# Altium project FafulaNandor25.PrjPcb
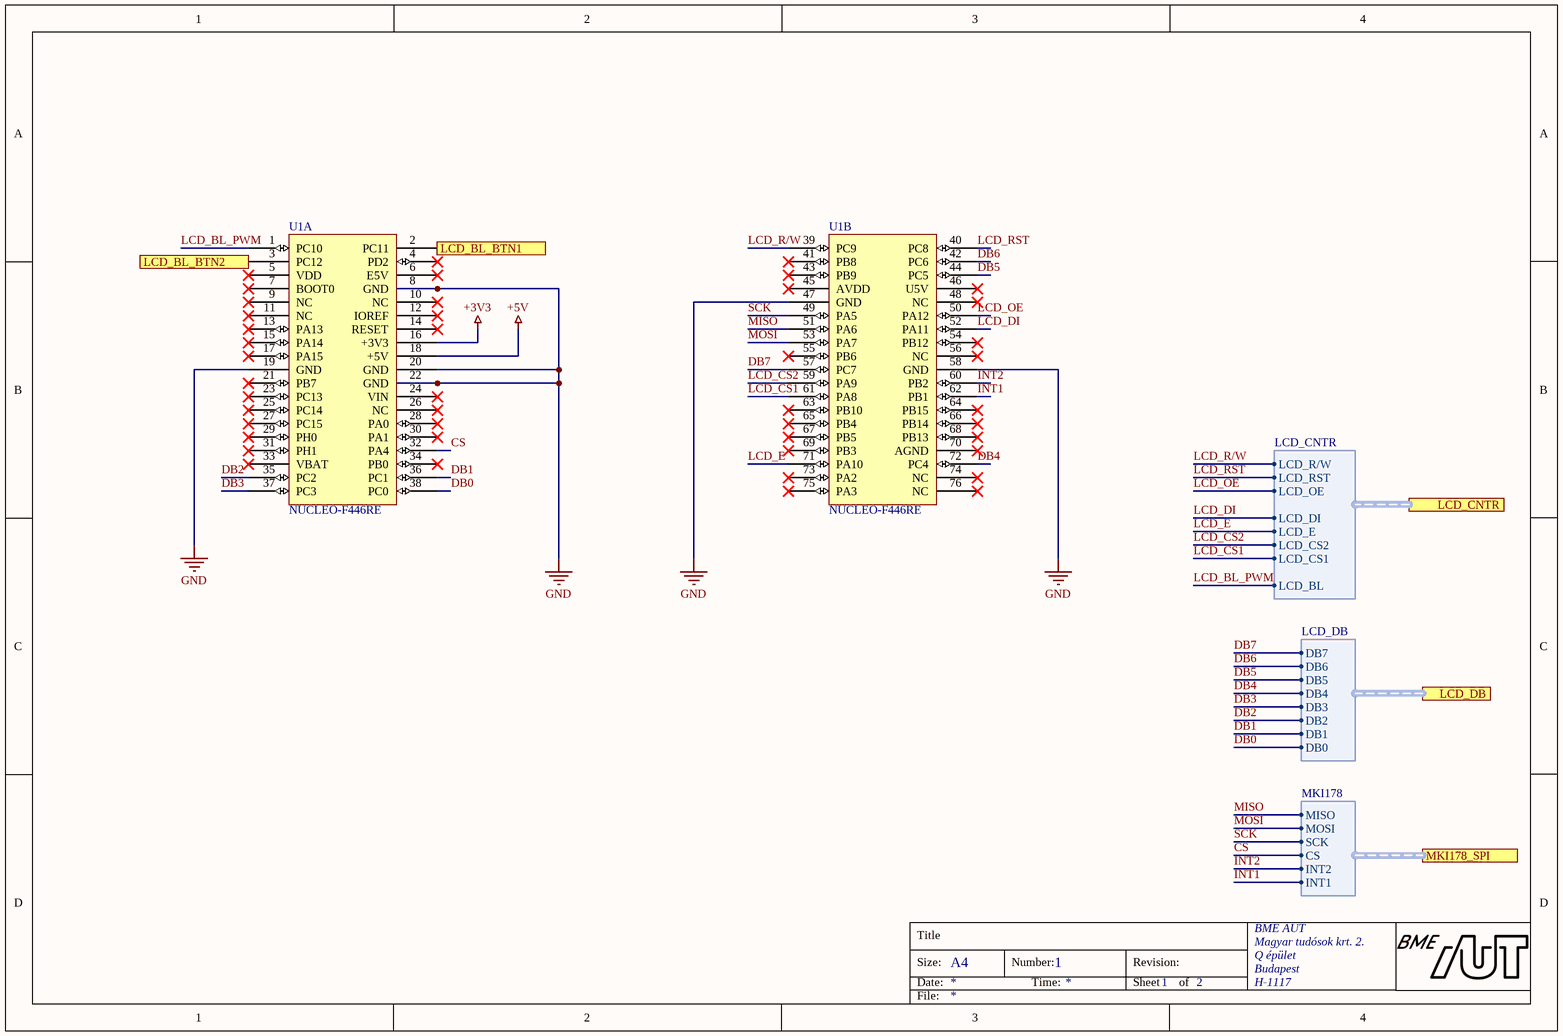
[diagram p0: Nucleo.SchDoc]
4 sheets, 28 parts. Net scope: flat (ports and power ports of the same name join across sheets).
Board file: PCB.PcbDoc
Sheets:
  Nucleo.SchDoc
  MKI178V1.SchDoc
  LCD.SchDoc
  BTN.SchDoc

## Sheet Nucleo.SchDoc
size A4; Organization: BME AUT; Address1: Magyar tudósok krt. 2.; Address2: Q épület; Address3: Budapest; Address4: H-1117; DocumentNumber: 1; SheetNumber: 1; SheetTotal: 2

### Parts
U1  NUCLEO-F446RE  [FP_NUCLEO-64]  (parts A,B of 2)

### Ports
LCD_BL_BTN1, LCD_BL_BTN2, LCD_CNTR (harness LCD_CNTR), LCD_DB (harness LCD_DB), MKI178_SPI (harness MKI178)

### Harnesses
MKI178: MISO, MOSI, SCK, CS, INT2, INT1
LCD_DB: DB0, DB1, DB2, DB3, DB4, DB5, DB6, DB7
LCD_CNTR: LCD_CS1, LCD_CS2, LCD_E, LCD_DI, LCD_RST, LCD_R/W, LCD_OE, LCD_BL

### Nets
+3V3: U1.16(+3V3)
+5V: U1.18(+5V)
GND: U1.8(GND) U1.19(GND) U1.20(GND) U1.22(GND) U1.47(GND) U1.58(GND)
CS: U1.32(PA4) ; port MKI178_SPI.CS
DB0: U1.38(PC0) ; port LCD_DB.DB0
DB1: U1.36(PC1) ; port LCD_DB.DB1
DB2: U1.35(PC2) ; port LCD_DB.DB2
DB3: U1.37(PC3) ; port LCD_DB.DB3
DB4: U1.72(PC4) ; port LCD_DB.DB4
DB5: U1.44(PC5) ; port LCD_DB.DB5
DB6: U1.42(PC6) ; port LCD_DB.DB6
DB7: U1.57(PC7) ; port LCD_DB.DB7
INT1: U1.62(PB1) ; port MKI178_SPI.INT1
INT2: U1.60(PB2) ; port MKI178_SPI.INT2
LCD_BL_PWM: U1.1(PC10) ; port LCD_CNTR.LCD_BL
LCD_CS1: U1.61(PA8) ; port LCD_CNTR.LCD_CS1
LCD_CS2: U1.59(PA9) ; port LCD_CNTR.LCD_CS2
LCD_DI: U1.52(PA11) ; port LCD_CNTR.LCD_DI
LCD_E: U1.71(PA10) ; port LCD_CNTR.LCD_E
LCD_OE: U1.50(PA12) ; port LCD_CNTR.LCD_OE
LCD_R/W: U1.39(PC9) ; port LCD_CNTR.LCD_R/W
LCD_RST: U1.40(PC8) ; port LCD_CNTR.LCD_RST
MISO: U1.51(PA6) ; port MKI178_SPI.MISO
MOSI: U1.53(PA7) ; port MKI178_SPI.MOSI
SCK: U1.49(PA5) ; port MKI178_SPI.SCK
NetB1_1: U1.2(PC11) ; port LCD_BL_BTN1
NetB2_1: U1.3(PC12) ; port LCD_BL_BTN2

Not connected (* = marked no-connect by the designer): U1 4(PD2)* 5(VDD)* 6(E5V)* 7(BOOT0)* 9(NC)* 10(NC)* 11(NC)* 12(IOREF)* 13(PA13)* 14(RESET)* 15(PA14)* 17(PA15)* 21(PB7)* 23(PC13)* 24(VIN)* 25(PC14)* 26(NC)* 27(PC15)* 28(PA0)* 29(PH0)* 30(PA1)* 31(PH1)* 33(VBAT)* 34(PB0)* 41(PB8)* 43(PB9)* 45(AVDD)* 46(U5V)* 48(NC)* 54(PB12)* 55(PB6)* 56(NC)* 63(PB10)* 64(PB15)* 65(PB4)* 66(PB14)* 67(PB5)* 68(PB13)* 69(PB3)* 70(AGND)* 73(PA2)* 74(NC)* 75(PA3)* 76(NC)*

### Notes on the sheet
- Title
- Size:
- Date:
- A4
- Number:
- Time:
- Revision:
- Sheet
- of
- File:

### Library data of the parts
U1 = NUCLEO-F446RE: Reference: NUCLEO; Name: Nucleo F446RE; Supplier: Tanszék

## Sheet MKI178V1.SchDoc
size A4
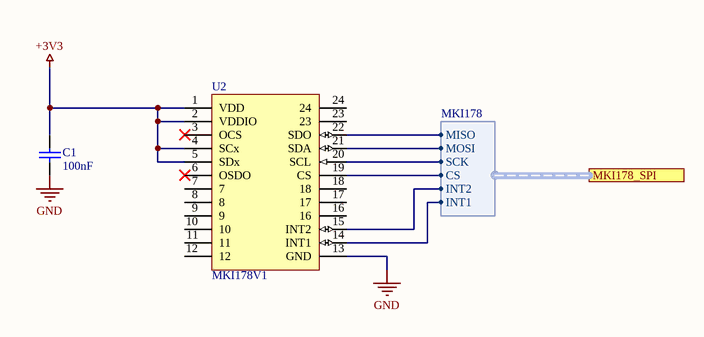
[diagram p1: MKI178V1.SchDoc]

### Parts
C1  100nF  [FP_0805_CAP_085]
U2  MKI178V1  [MKI178V1]

### Ports
MKI178_SPI (harness MKI178)

### Harnesses
MKI178: MISO, MOSI, SCK, CS, INT2, INT1

### Nets
+3V3: C1.2 U2.1(VDD) U2.2(VDDIO) U2.4(SCx) U2.5(SDx)
GND: C1.1 U2.13(GND)
CS: U2.19(CS) ; port MKI178_SPI.CS
INT1: U2.14(INT1) ; port MKI178_SPI.INT1
INT2: U2.15(INT2) ; port MKI178_SPI.INT2
MISO: U2.22(SDO) ; port MKI178_SPI.MISO
MOSI: U2.21(SDA) ; port MKI178_SPI.MOSI
SCK: U2.20(SCL) ; port MKI178_SPI.SCK

Not connected (* = marked no-connect by the designer): U2 3(OCS)* 6(OSDO)* 7 8 9 10 11 12 16 17 18 23 24

### Library data of the parts
C1 = 100nF_0805_CAP: Capacitor; Value: 100nF
U2 = MKI178V1: Supplier: Tanszék

## Sheet LCD.SchDoc
size A4
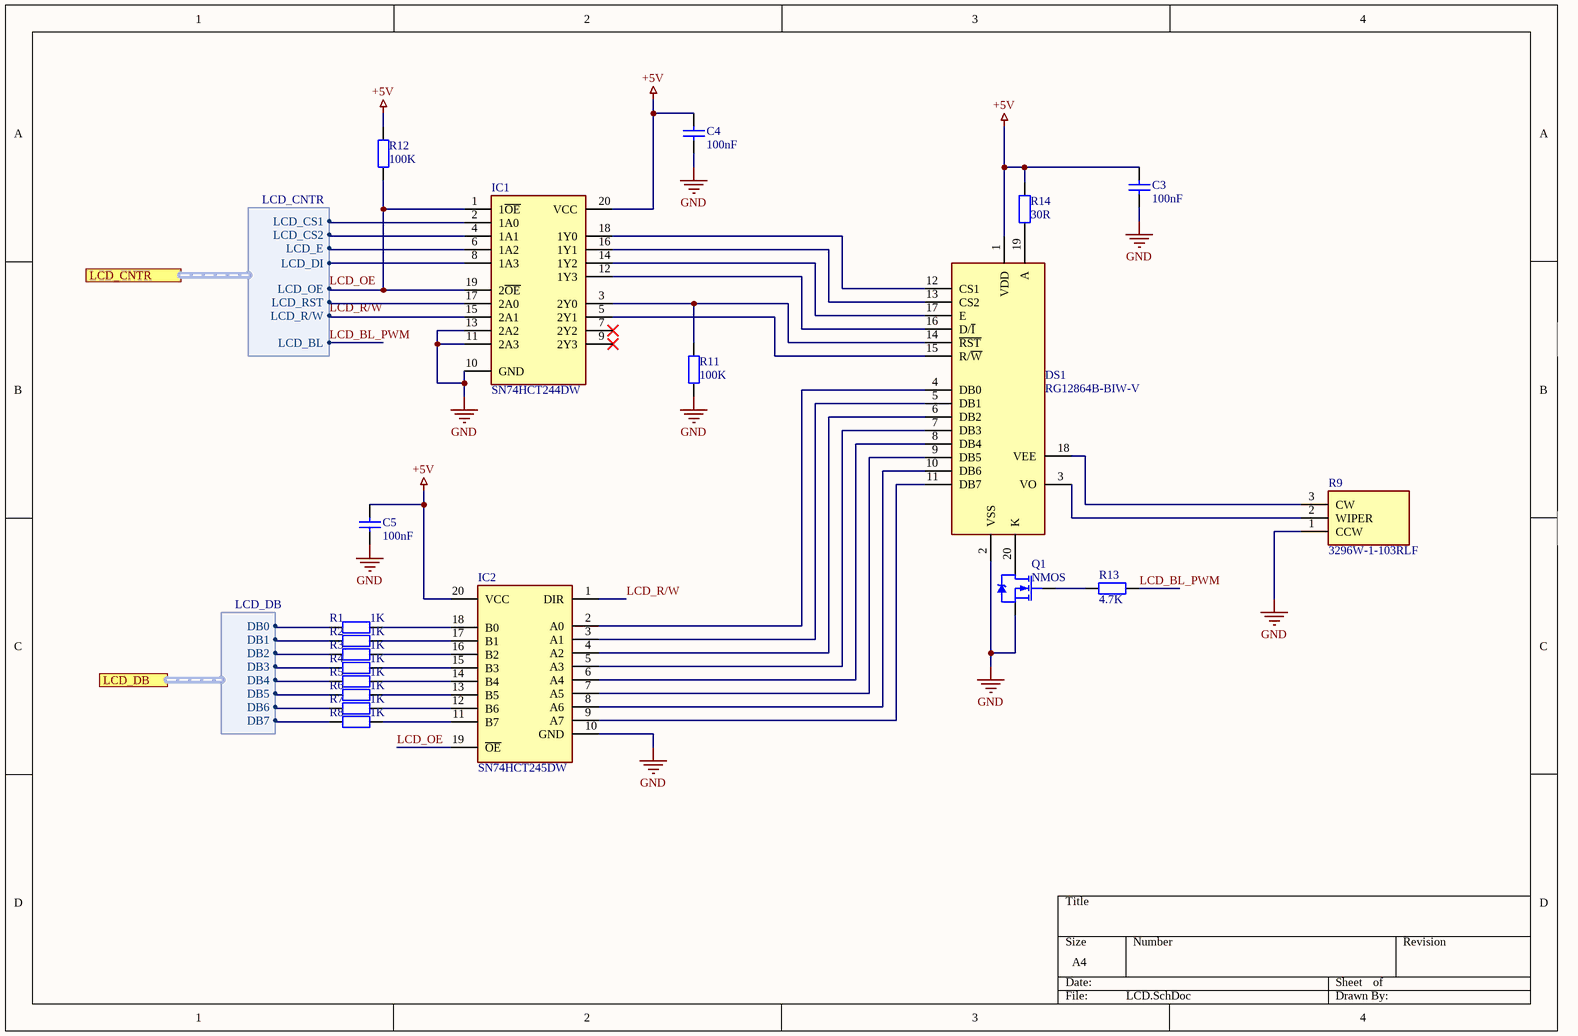
[diagram p2: LCD.SchDoc]

### Parts
C3  100nF  [FP_0805_CAP_085]
C4  100nF  [FP_0805_CAP_085]
C5  100nF  [FP_0805_CAP_085]
DS1  RG12864B-BIW-V  [RG12864B-BIW-V_AUT]
IC1  SN74HCT244DW  [SN74HCT244DW]
IC2  SN74HCT245DW  [SN74HCT245DW]
Q1  NMOS  [FP_SOT23-3]
R1  1K  [FP_0805_RES]
R2  1K  [FP_0805_RES]
R3  1K  [FP_0805_RES]
R4  1K  [FP_0805_RES]
R5  1K  [FP_0805_RES]
R6  1K  [FP_0805_RES]
R7  1K  [FP_0805_RES]
R8  1K  [FP_0805_RES]
R9  3296W-1-103RLF  [3296W-1-103R]
R11  100K  [FP_0805_RES]
R12  100K  [FP_0805_RES]
R13  4.7K  [FP_0805_RES]
R14  30R  [FP_0805_RES]

### Ports
LCD_CNTR (harness LCD_CNTR), LCD_DB (harness LCD_DB)

### Harnesses
LCD_DB: DB0, DB1, DB2, DB3, DB4, DB5, DB6, DB7
LCD_CNTR: LCD_CS1, LCD_CS2, LCD_E, LCD_DI, LCD_RST, LCD_R/W, LCD_OE, LCD_BL

### Nets
+5V: C3.2 C4.2 C5.2 DS1.1(VDD) IC1.20(VCC) IC2.20(VCC) R12.1 R14.2
GND: C3.1 C4.1 C5.1 DS1.2(VSS) IC1.10(GND) IC1.11(2A3) IC1.13(2A2) IC2.10(GND) Q1.3(S) R9.1(CCW) R11.1
DB0: R1.1 ; port LCD_DB.DB0
DB1: R2.1 ; port LCD_DB.DB1
DB2: R3.1 ; port LCD_DB.DB2
DB3: R4.1 ; port LCD_DB.DB3
DB4: R5.1 ; port LCD_DB.DB4
DB5: R6.1 ; port LCD_DB.DB5
DB6: R7.1 ; port LCD_DB.DB6
DB7: R8.1 ; port LCD_DB.DB7
LCD_BL_PWM: R13.2 ; port LCD_CNTR.LCD_BL
LCD_CS1: IC1.2(1A0) ; port LCD_CNTR.LCD_CS1
LCD_CS2: IC1.4(1A1) ; port LCD_CNTR.LCD_CS2
LCD_DI: IC1.8(1A3) ; port LCD_CNTR.LCD_DI
LCD_E: IC1.6(1A2) ; port LCD_CNTR.LCD_E
LCD_OE: IC1.1(1~{OE}) IC1.19(2~{OE}) IC2.19(~{OE}) R12.2 ; port LCD_CNTR.LCD_OE
LCD_R/W: IC1.15(2A1) IC2.1(DIR) ; port LCD_CNTR.LCD_R/W
LCD_RST: IC1.17(2A0) ; port LCD_CNTR.LCD_RST
NetDS1_3: DS1.3(VO) R9.2(WIPER)
NetDS1_4: DS1.4(DB0) IC2.2(A0)
NetDS1_5: DS1.5(DB1) IC2.3(A1)
NetDS1_6: DS1.6(DB2) IC2.4(A2)
NetDS1_7: DS1.7(DB3) IC2.5(A3)
NetDS1_8: DS1.8(DB4) IC2.6(A4)
NetDS1_9: DS1.9(DB5) IC2.7(A5)
NetDS1_10: DS1.10(DB6) IC2.8(A6)
NetDS1_11: DS1.11(DB7) IC2.9(A7)
NetDS1_12: DS1.12(CS1) IC1.18(1Y0)
NetDS1_13: DS1.13(CS2) IC1.16(1Y1)
NetDS1_14: DS1.14(~{RST}) IC1.3(2Y0) R11.2
NetDS1_15: DS1.15(R/~{W}) IC1.5(2Y1)
NetDS1_16: DS1.16(D/~{I}) IC1.12(1Y3)
NetDS1_17: DS1.17(E) IC1.14(1Y2)
NetDS1_18: DS1.18(VEE) R9.3(CW)
NetDS1_19: DS1.19(A) R14.1
NetDS1_20: DS1.20(K) Q1.2(D)
NetIC2_11: IC2.11(B7) R8.2
NetIC2_12: IC2.12(B6) R7.2
NetIC2_13: IC2.13(B5) R6.2
NetIC2_14: IC2.14(B4) R5.2
NetIC2_15: IC2.15(B3) R4.2
NetIC2_16: IC2.16(B2) R3.2
NetIC2_17: IC2.17(B1) R2.2
NetIC2_18: IC2.18(B0) R1.2
NetQ1_1: Q1.1(G) R13.1

Not connected (* = marked no-connect by the designer): DS1 MH1 MH2 MH3 MH4; IC1 7(2Y2)* 9(2Y3)*

### Library data of the parts
C3-C5 = 100nF_0805_CAP: Capacitor; Value: 100nF
DS1 = RG12864B-BIW-V: Display; Manufacturer_Name: RAYSTAR; Manufacturer_Part_Number: RG12864B-GHW-V; Datasheet Link: https://www.tme.eu/Document/ad0edd8197c217e1346010bf2253878c/RG12864B-GHW-V.pdf; Height: 5.9mm; Supplier: Lomex; Reference: 37-00-81
IC1 = SN74HCT244DW: Integrated Circuit; Manufacturer_Name: Texas Instruments; Datasheet Link: http://www.ti.com/lit/ds/symlink/sn74hct244.pdf; Height: 2.65mm; Manufacturer_Part_Number: SN74HCT244DW; Mouser Part Number: 595-SN74HCT244DW; Mouser Price/Stock: https://www.mouser.co.uk/ProductDetail/Texas-Instruments/SN74HCT244DW?qs=8yeEWhuAOtPaf02S2l6zdA%3D%3D; Arrow Part Number: SN74HCT244DW; Arrow Price/Stock: https://www.arrow.com/en/products/sn74hct244dw/texas-instruments
IC2 = SN74HCT245DW: Integrated Circuit; Manufacturer_Name: Texas Instruments; Datasheet Link: http://www.ti.com/lit/ds/symlink/sn74hct245.pdf; Height: 2.65mm; Manufacturer_Part_Number: SN74HCT245DW; Mouser Part Number: 595-SN74HCT245DW; Mouser Price/Stock: https://www.mouser.co.uk/ProductDetail/Texas-Instruments/SN74HCT245DW?qs=5h8QSfodyRguwsnqzMvAgw%3D%3D; Arrow Part Number: SN74HCT245DW; Arrow Price/Stock: https://www.arrow.com/en/products/sn74hct245dw/texas-instruments?region=nac
Q1 = Si2308BDS: pin to pad: 2>3 3>2; Name: N-FET; Supplier: Lomex; Reference: 86-02-05
R1-R8 = 1K_0805_RES: Resistor; Value: 1K
R9 = 3296W-1-103RLF: Resistor; Manufacturer_Name: Bourns; Datasheet Link: https://www.bourns.com/pdfs/3296.pdf; Manufacturer_Part_Number: 3296W-1-103RLF; Mouser Part Number: 652-3296W-1-103RLF; Mouser Price/Stock: https://www.mouser.co.uk/ProductDetail/Bourns/3296W-1-103RLF?qs=2bTIwLLrckTSiNyA4dRdUg%3D%3D; Arrow Part Number: 3296W-1-103RLF; Arrow Price/Stock: https://www.arrow.com/en/products/3296w-1-103rlf/bourns?region=nac; Supplier: Lomex; Reference: 05-05-89
R11 = 10K_0805_RES: Resistor; Value: 100K
R12 = 100K_0805_RES: Resistor; Value: 100K
R13 = 4_7K_0805_RES: Resistor; Value: 4.7K
R14 = 30R_0805_RES: Resistor; Value: 30R

## Sheet BTN.SchDoc
size A4
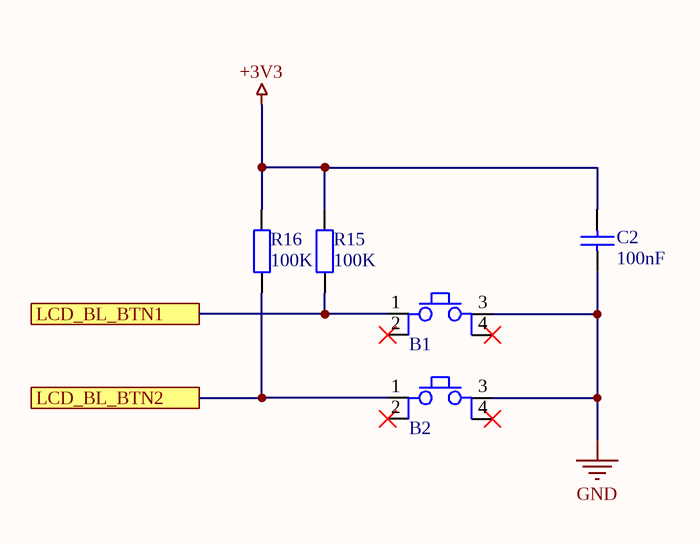
[diagram p3: BTN.SchDoc]

### Parts
B1  Button  [FSM4JSMA_AUT]  (value not drawn)
B2  Button  [FSM4JSMA_AUT]  (value not drawn)
C2  100nF  [FP_0805_CAP_085]
R15  100K  [FP_0805_RES]
R16  100K  [FP_0805_RES]

### Ports
LCD_BL_BTN1, LCD_BL_BTN2

### Nets
+3V3: C2.2 R15.2 R16.2
GND: B1.3 B2.3 C2.1
NetB1_1: B1.1 R15.1 ; port LCD_BL_BTN1
NetB2_1: B2.1 R16.1 ; port LCD_BL_BTN2

Not connected (* = marked no-connect by the designer): B1 2* 4*; B2 2* 4*

### Library data of the parts
B1 B2 = FSM4JSMA_AUT: Push button
C2 = 100nF_0805_CAP: Capacitor; Value: 100nF
R15 R16 = 100K_0805_RES: Resistor; Value: 100K

## Nets that join several sheets
+3V3: Nucleo (U1.16), MKI178V1 (5 pins), BTN (C2.2 R15.2 R16.2)
+5V: Nucleo (U1.18), LCD (8 pins)
GND: Nucleo (6 pins), MKI178V1 (C1.1 U2.13), LCD (11 pins), BTN (B1.3 B2.3 C2.1)
CS: Nucleo (U1.32), MKI178V1 (U2.19)
DB0: Nucleo (U1.38), LCD (R1.1)
DB1: Nucleo (U1.36), LCD (R2.1)
DB2: Nucleo (U1.35), LCD (R3.1)
DB3: Nucleo (U1.37), LCD (R4.1)
DB4: Nucleo (U1.72), LCD (R5.1)
DB5: Nucleo (U1.44), LCD (R6.1)
DB6: Nucleo (U1.42), LCD (R7.1)
DB7: Nucleo (U1.57), LCD (R8.1)
INT1: Nucleo (U1.62), MKI178V1 (U2.14)
INT2: Nucleo (U1.60), MKI178V1 (U2.15)
LCD_BL_PWM: Nucleo (U1.1), LCD (R13.2)
LCD_CS1: Nucleo (U1.61), LCD (IC1.2)
LCD_CS2: Nucleo (U1.59), LCD (IC1.4)
LCD_DI: Nucleo (U1.52), LCD (IC1.8)
LCD_E: Nucleo (U1.71), LCD (IC1.6)
LCD_OE: Nucleo (U1.50), LCD (IC1.1 IC1.19 IC2.19 R12.2)
LCD_R/W: Nucleo (U1.39), LCD (IC1.15 IC2.1)
LCD_RST: Nucleo (U1.40), LCD (IC1.17)
MISO: Nucleo (U1.51), MKI178V1 (U2.22)
MOSI: Nucleo (U1.53), MKI178V1 (U2.21)
NetB1_1: Nucleo (U1.2), BTN (B1.1 R15.1)
NetB2_1: Nucleo (U1.3), BTN (B2.1 R16.1)
SCK: Nucleo (U1.49), MKI178V1 (U2.20)